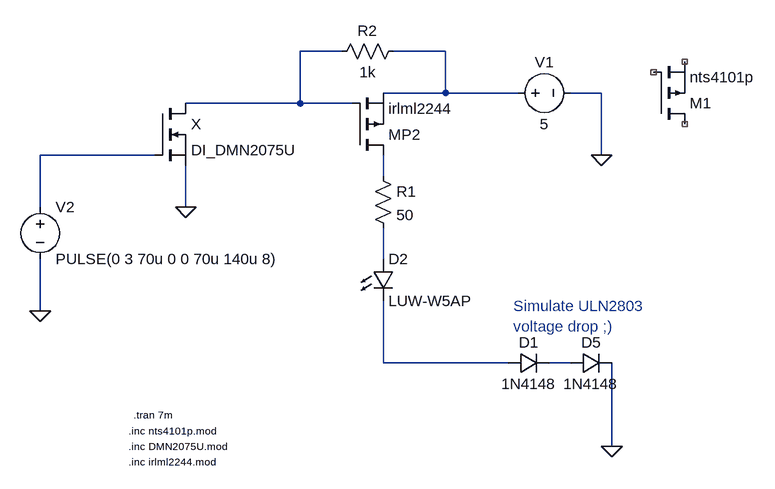
[diagram p0: schematic PWM.asc]
PWM.asc, the LTspice schematic file:
Version 4
SHEET 1 1072 680
WIRE 80 -272 16 -272
WIRE 240 -272 160 -272
WIRE 240 -208 240 -272
WIRE 240 -208 144 -208
WIRE 352 -208 240 -208
WIRE 480 -208 432 -208
WIRE 16 -192 16 -272
WIRE 16 -192 -160 -192
WIRE 96 -192 16 -192
WIRE -208 -112 -384 -112
WIRE 480 -112 480 -208
WIRE 144 -80 144 -112
WIRE -384 -32 -384 -112
WIRE -160 -32 -160 -96
WIRE 144 48 144 0
WIRE -384 128 -384 48
WIRE 144 208 144 112
WIRE 336 208 144 208
WIRE 432 208 400 208
WIRE 496 336 496 208
FLAG 496 336 0
FLAG -384 128 0
FLAG 480 -112 0
FLAG -160 -32 0
SYMBOL diode 336 224 R270
WINDOW 0 32 32 VTop 2
WINDOW 3 0 32 VBottom 2
SYMATTR InstName D1
SYMATTR Value 1N4148
SYMBOL LED 128 48 R0
SYMATTR InstName D2
SYMATTR Value LUW-W5AP
SYMBOL res 128 -96 R0
SYMATTR InstName R1
SYMATTR Value 50
SYMBOL voltage 336 -208 R270
WINDOW 0 32 56 VTop 2
WINDOW 3 -32 56 VBottom 2
WINDOW 123 0 0 Left 2
WINDOW 39 0 0 Left 2
SYMATTR InstName V1
SYMATTR Value 5
SYMBOL voltage -384 -48 R0
WINDOW 123 0 0 Left 2
WINDOW 39 24 44 Left 2
SYMATTR InstName V2
SYMATTR Value PULSE(0 3 70u 0 0 70u 140u 8)
SYMBOL nmos -208 -192 R0
SYMATTR InstName X
SYMATTR Value DI_DMN2075U
SYMATTR Prefix X
SYMBOL diode 432 224 R270
WINDOW 0 32 32 VTop 2
WINDOW 3 0 32 VBottom 2
SYMATTR InstName D5
SYMATTR Value 1N4148
SYMBOL pmos 560 -160 M180
SYMATTR InstName M1
SYMATTR Value nts4101p
SYMATTR Prefix X
SYMBOL res 176 -288 R90
WINDOW 0 0 56 VBottom 2
WINDOW 3 32 56 VTop 2
SYMATTR InstName R2
SYMATTR Value 1k
SYMBOL pmos 96 -112 M180
SYMATTR InstName MP2
SYMATTR Value irlml2244
SYMATTR Prefix X
TEXT -240 288 Left 1 !.tran 7m
TEXT -248 336 Left 1 !.inc DMN2075U.mod
TEXT 344 120 Left 2 ;Simulate ULN2803\nvoltage drop ;)
TEXT -248 312 Left 1 !.inc nts4101p.mod
TEXT -248 360 Left 1 !.inc irlml2244.mod

The netlist it stands for:
* PWM.asc
D1 N006 N007 1N4148
D2 N005 N006 LUW-W5AP
R1 N004 N005 50
V1 N002 0 5
V2 N003 0 PULSE(0 3 70u 0 0 70u 140u 8)
XX N001 N003 0 DI_DMN2075U  ; pins D G S
D5 N007 0 1N4148
XM1 NC_01 NC_02 NC_03 nts4101p  ; pins D G S
R2 N002 N001 1k
XMP2 N004 N001 N002 irlml2244  ; pins D G S
.model D D
.lib standard.dio
.tran 7m
.inc DMN2075U.mod
* Simulate ULN2803
* voltage drop ;)
.inc nts4101p.mod
.inc irlml2244.mod
.backanno
.end